# EAGLE design Hlibok_PCB (EAGLE 9.6.2)
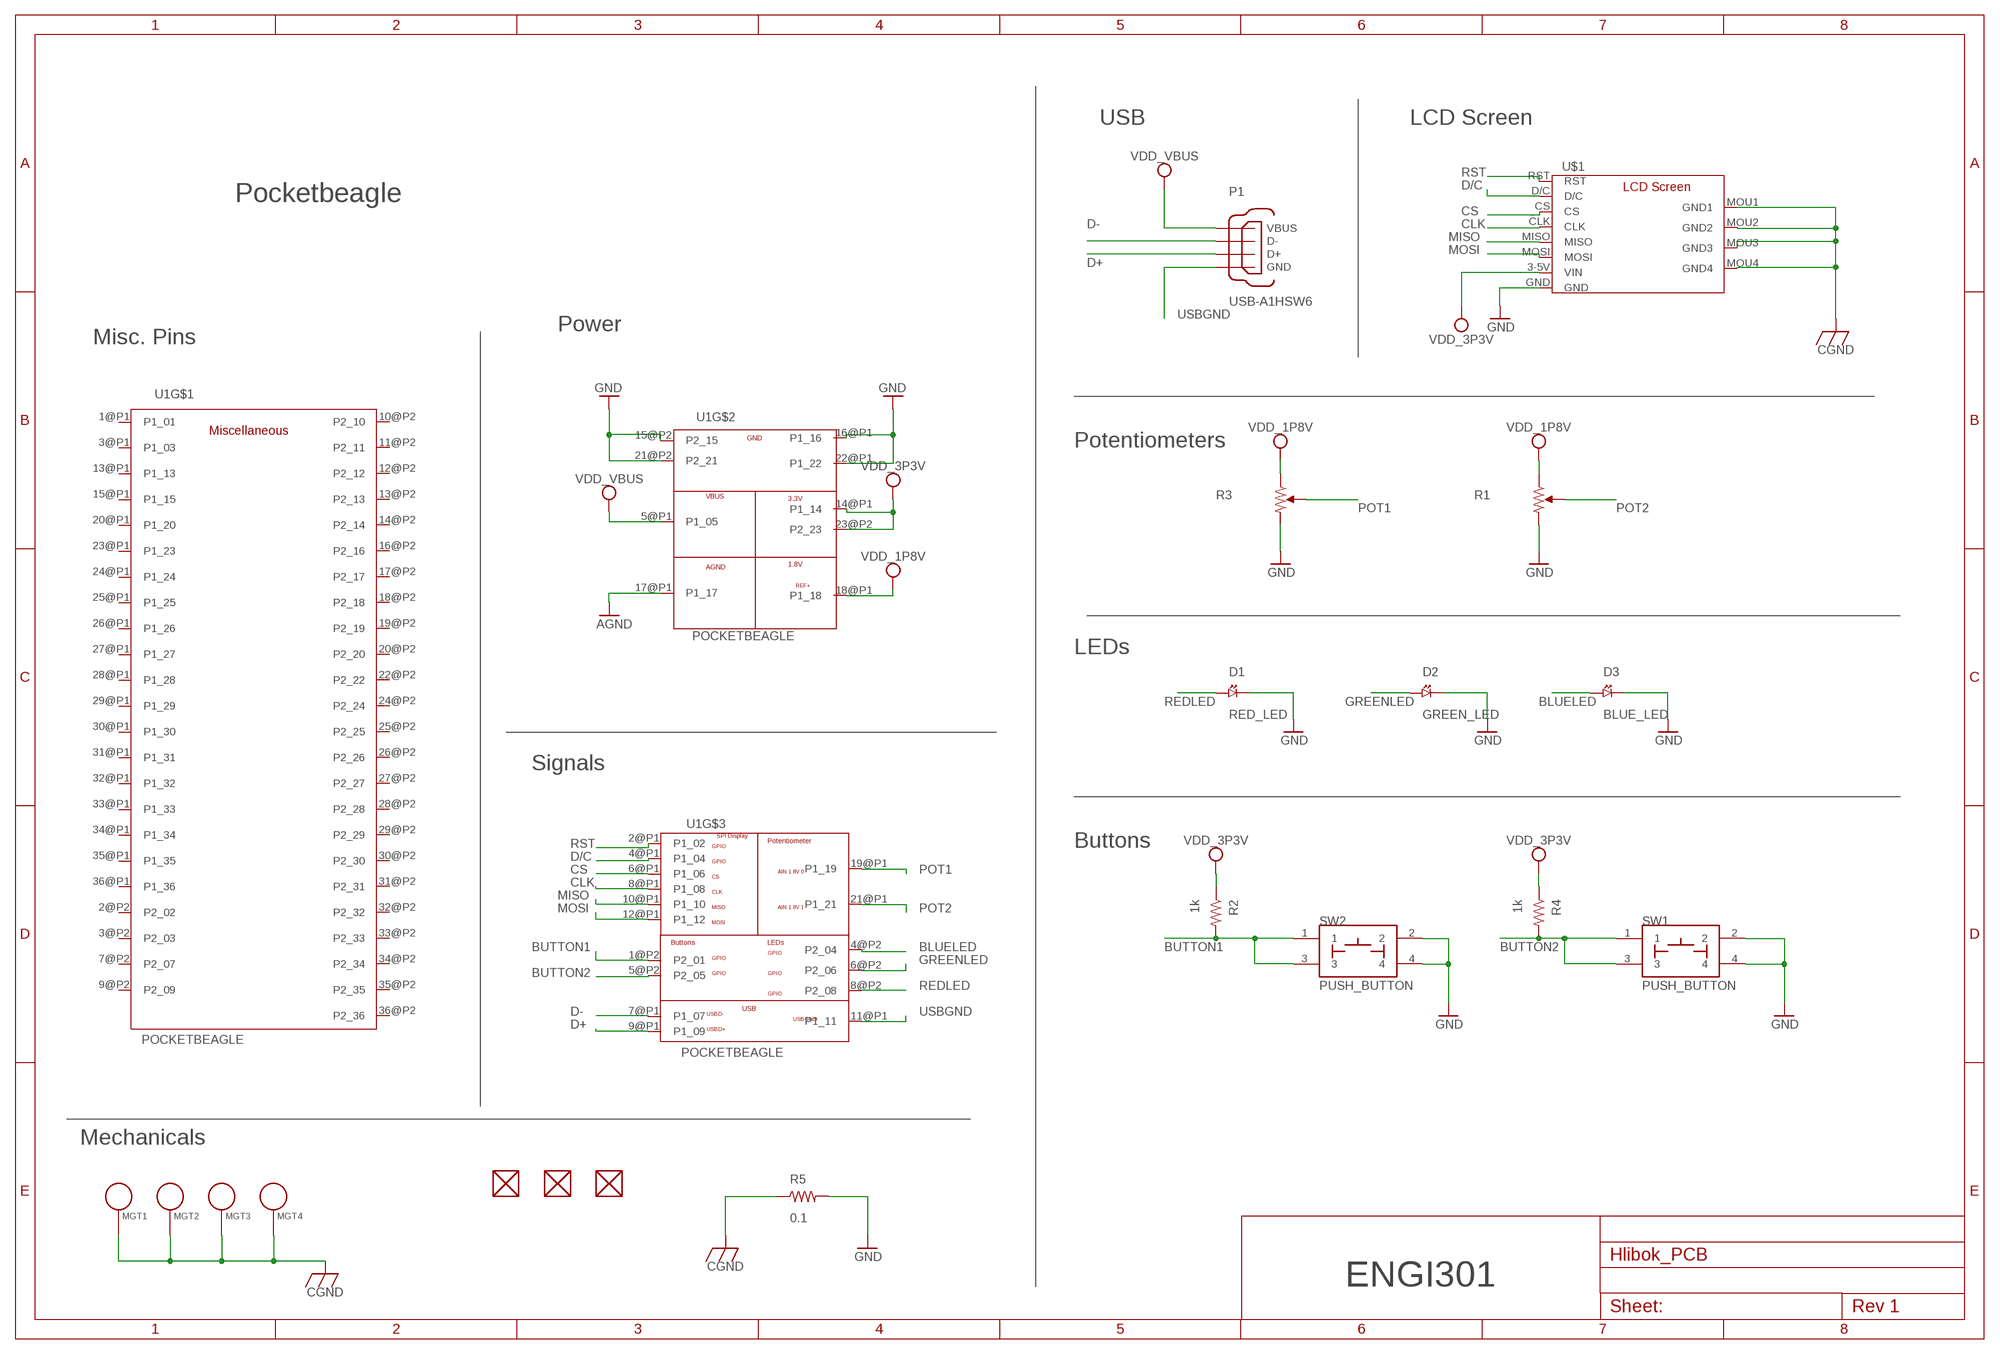
[diagram p0: schematic, sheet 1]

## Parts
D1  RED_LED  LED  [EIA-STD]
D2  GREEN_LED  LED  [EIA-STD]
D3  BLUE_LED  LED  [EIA-STD]
FUD1  FIDUCIAL  [FIDUCIAL_40MIL]
FUD2  FIDUCIAL  [FIDUCIAL_40MIL]
FUD3  FIDUCIAL  [FIDUCIAL_40MIL]
MGT1  MOUNTING_HOLE  [MOUNTING_HOLE]
MGT2  MOUNTING_HOLE  [MOUNTING_HOLE]
MGT3  MOUNTING_HOLE  [MOUNTING_HOLE]
MGT4  MOUNTING_HOLE  [MOUNTING_HOLE]
P1  USB-A1HSW6  [USB]
R1  POTENTIOMETER  [POT-PO90S]
R2  1k  R_R0603  [R0603]
R3  POTENTIOMETER  [POT-PO90S]
R4  1k  R_R0603  [R0603]
R5  0.1  R_R0805  [R0805]
SW1  PUSH_BUTTON  [BUTTON_12.5MM]
SW2  PUSH_BUTTON  [BUTTON_12.5MM]
U1  POCKETBEAGLE  [POCKETBEAGLE]
U$1  SCREEN  [SCREEN]

## Nets
BLUELED: D3.ANODE U1.4@P2(P2_04)
BUTTON1: R2.2 SW2.1 SW2.3 U1.1@P2(P2_01)
BUTTON2: R4.2 SW1.1 SW1.3 U1.5@P2(P2_05)
CGND: MGT1.P$1 MGT2.P$1 MGT3.P$1 MGT4.P$1 R5.1 U$1.MOU1(GND1) U$1.MOU2(GND2) U$1.MOU3(GND3) U$1.MOU4(GND4)
CLK: U1.8@P1(P1_08) U$1.CLK
CS: U1.6@P1(P1_06) U$1.CS
D+: P1.3(D+) U1.9@P1(P1_09)
D-: P1.2(D-) U1.7@P1(P1_07)
D/C: U1.4@P1(P1_04) U$1.D/C
GND: D1.CATHODE D2.CATHODE D3.CATHODE R1.CW R3.CW R5.2 SW1.2 SW1.4 SW2.2 SW2.4 U1.15@P2(P2_15) U1.16@P1(P1_16) U1.17@P1(P1_17) U1.21@P2(P2_21) U1.22@P1(P1_22) U$1.GND ; supply symbol labelled AGND
GREENLED: D2.ANODE U1.6@P2(P2_06)
MISO: U1.10@P1(P1_10) U$1.MISO
MOSI: U1.12@P1(P1_12) U$1.MOSI
POT1: R3.S U1.19@P1(P1_19)
POT2: R1.S U1.21@P1(P1_21)
REDLED: D1.ANODE U1.8@P2(P2_08)
RST: U1.2@P1(P1_02) U$1.RST
USBGND: P1.4(GND) U1.11@P1(P1_11)
VDD_1P8V: R1.CCW R3.CCW U1.18@P1(P1_18)
VDD_3P3V: R2.1 R4.1 U1.14@P1(P1_14) U1.23@P2(P2_23) U$1.3-5V(VIN)
VDD_5V: P1.1(VBUS) U1.5@P1(P1_05) ; supply symbol labelled VDD_VBUS
Unconnected: FUD1.P$1 FUD2.P$1 FUD3.P$1 U1.1@P1(P1_01) U1.2@P2(P2_02) U1.3@P1(P1_03) U1.3@P2(P2_03) U1.7@P2(P2_07) U1.9@P2(P2_09) U1.10@P2(P2_10) U1.11@P2(P2_11) U1.12@P2(P2_12) U1.13@P1(P1_13) U1.13@P2(P2_13) U1.14@P2(P2_14) U1.15@P1(P1_15) U1.16@P2(P2_16) U1.17@P2(P2_17) U1.18@P2(P2_18) U1.19@P2(P2_19) U1.20@P1(P1_20) U1.20@P2(P2_20) U1.22@P2(P2_22) U1.23@P1(P1_23) U1.24@P1(P1_24) U1.24@P2(P2_24) U1.25@P1(P1_25) U1.25@P2(P2_25) U1.26@P1(P1_26) U1.26@P2(P2_26) U1.27@P1(P1_27) U1.27@P2(P2_27) U1.28@P1(P1_28) U1.28@P2(P2_28) U1.29@P1(P1_29) U1.29@P2(P2_29) U1.30@P1(P1_30) U1.30@P2(P2_30) U1.31@P1(P1_31) U1.31@P2(P2_31) U1.32@P1(P1_32) U1.32@P2(P2_32) U1.33@P1(P1_33) U1.33@P2(P2_33) U1.34@P1(P1_34) U1.34@P2(P2_34) U1.35@P1(P1_35) U1.35@P2(P2_35) U1.36@P1(P1_36) U1.36@P2(P2_36)

## Notes on the sheet
- USB | LCD Screen
- Pocketbeagle
- Power
- Misc. Pins
- Potentiometers
- LEDs
- Signals
- Buttons
- Mechanicals
- ENGI301

## Library data of the parts
D1-D3 = Hlibok_PCB:LED: LTST-C191TBKT
FUD1-FUD3 = Hlibok_PCB:FIDUCIAL
MGT1-MGT4 = Hlibok_PCB:MOUNTING_HOLE: Chassis Mounting Hole w/GND connection ability
P1 = Hlibok_PCB:USB-A1HSW6: USB - A Receptacle Connector 4 Position Through Hole, Right Angle Check availability <https://pricing.snapeda.com/parts/USB-A1HSW6/On%20Shore/view-part?ref=eda>; AVAILABILITY: In Stock; CHECK_PRICES: https://www.snapeda.com/parts/USB-A1HSW6/On+Shore+Technology+Inc./view-part/?ref=eda; DESCRIPTION: USB-A (USB TYPE-A) - Receptacle Connector 4 Position Through Hole, Right Angle; MF: On Shore; MP: USB-A1HSW6; PACKAGE: None; PRICE: None; PURCHASE-URL: https://www.snapeda.com/api/url_track_click_mouser/?unipart_id=13110&manufacturer=On Shore&part_name=USB-A1HSW6&search_term=usb; SNAPEDA_LINK: https://www.snapeda.com/parts/USB-A1HSW6/On+Shore+Technology+Inc./view-part/?ref=snap
R1 R3 = Hlibok_PCB:POTENTIOMETER: Potentiometer - Examples: P090S-14T20BR10K (987-1277-ND)
R2 R4 R5 = Hlibok_PCB:R_: RESISTOR, American symbol
SW1 SW2 = Hlibok_PCB:PUSH_BUTTON
U1 = Hlibok_PCB:POCKETBEAGLE
U$1 = Hlibok_PCB:SCREEN

## Board
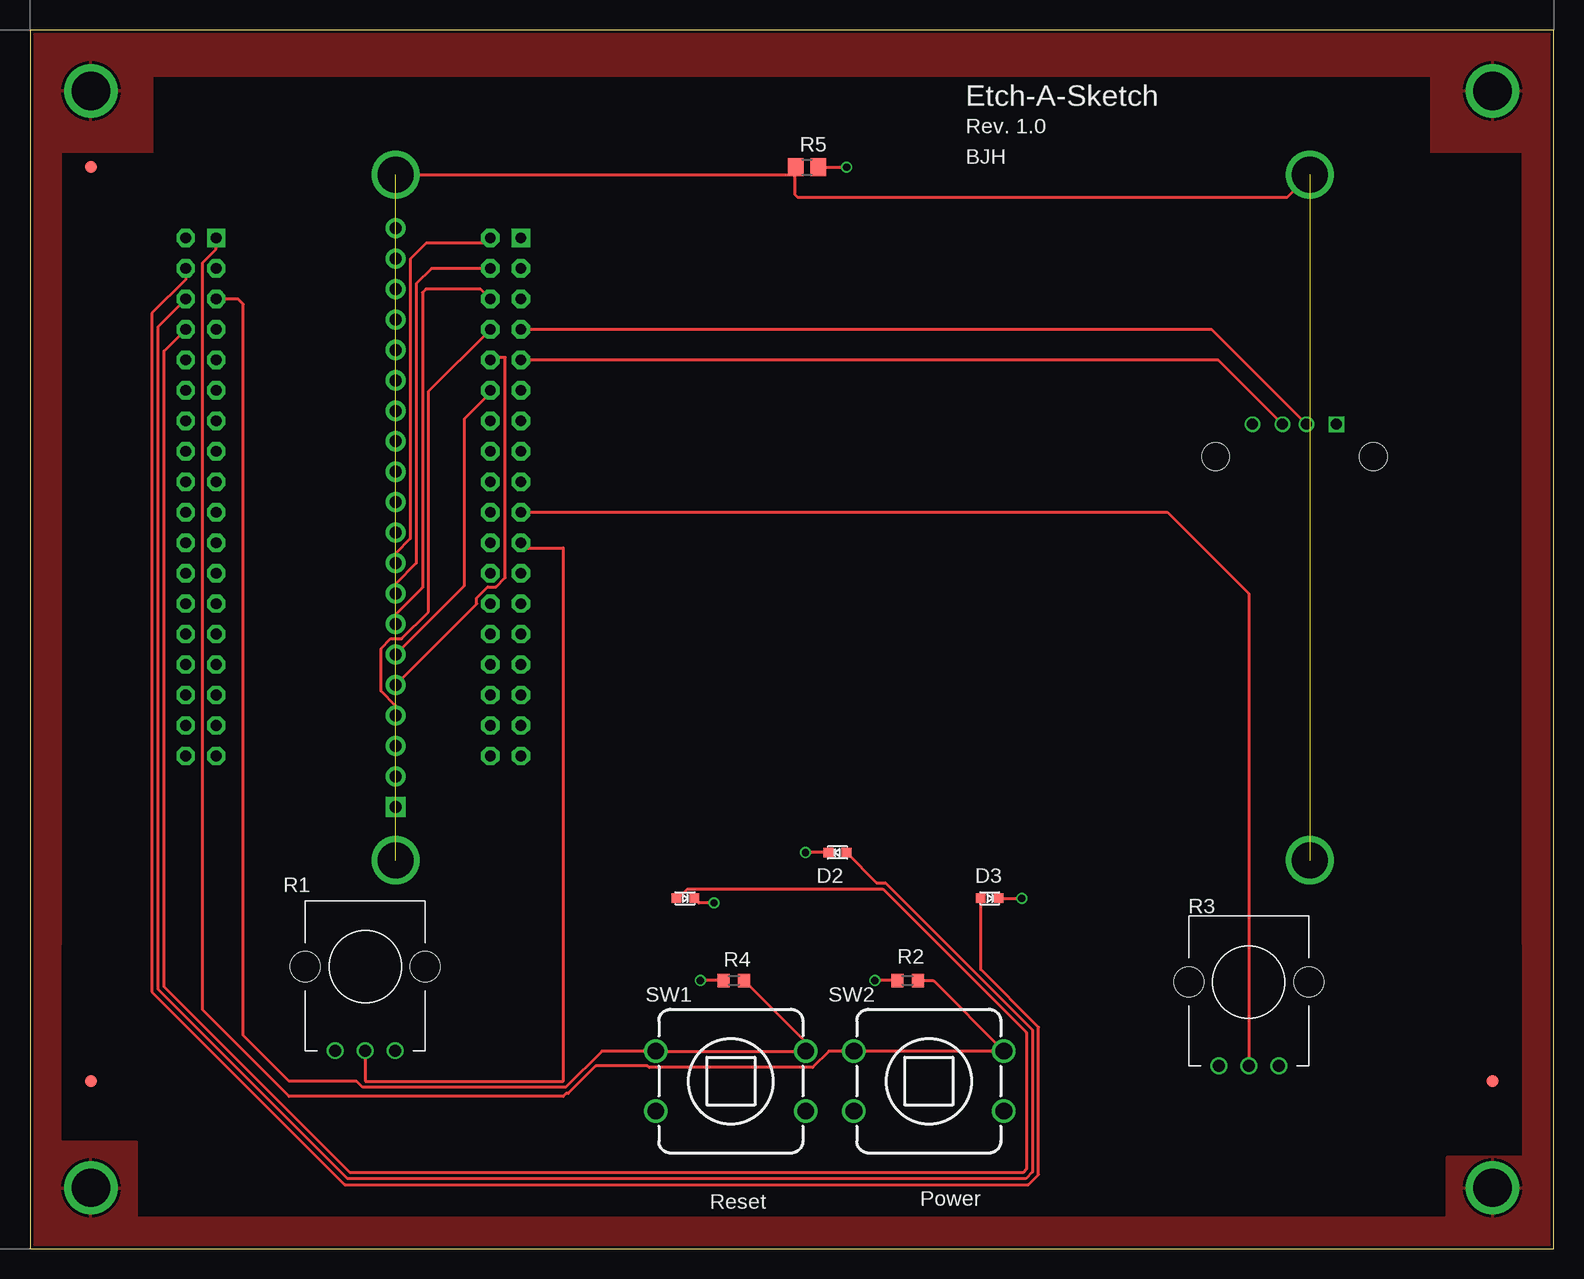
[diagram p1: board, top side]
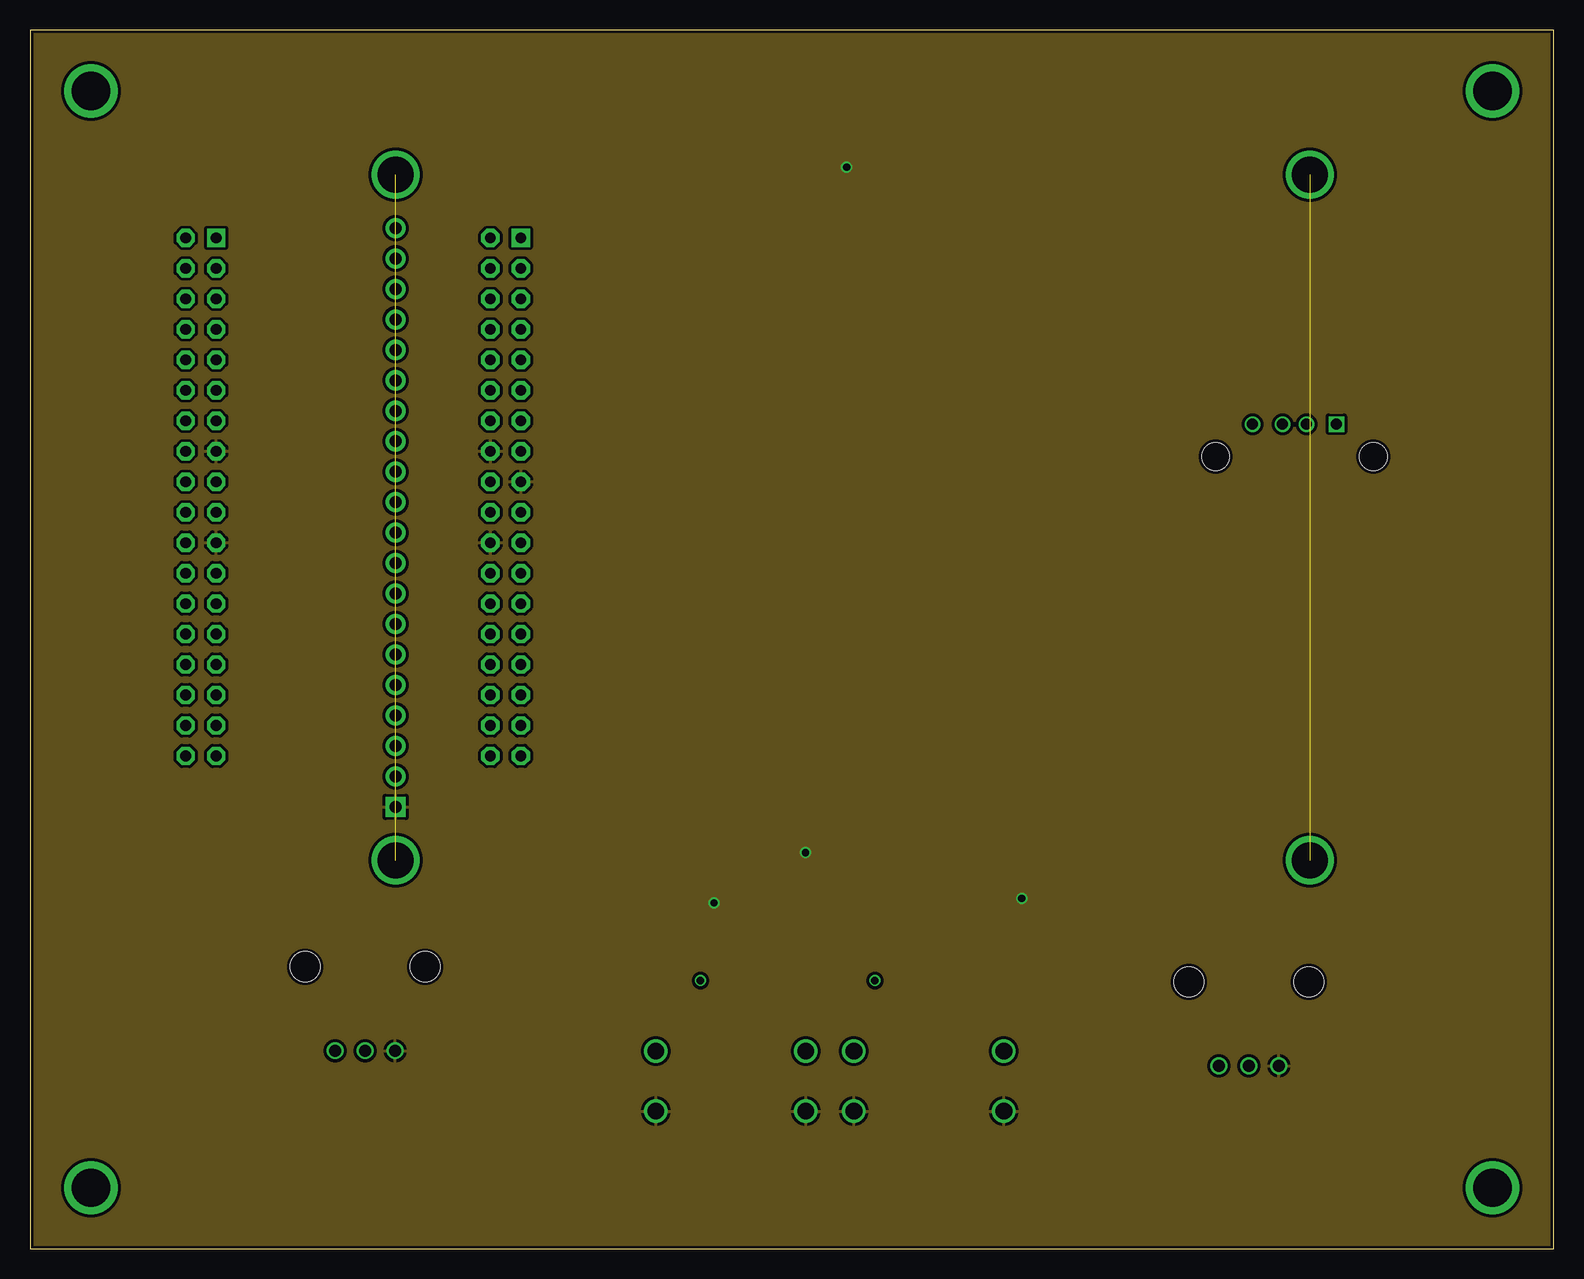
[diagram p2: board, inner layer Route2]
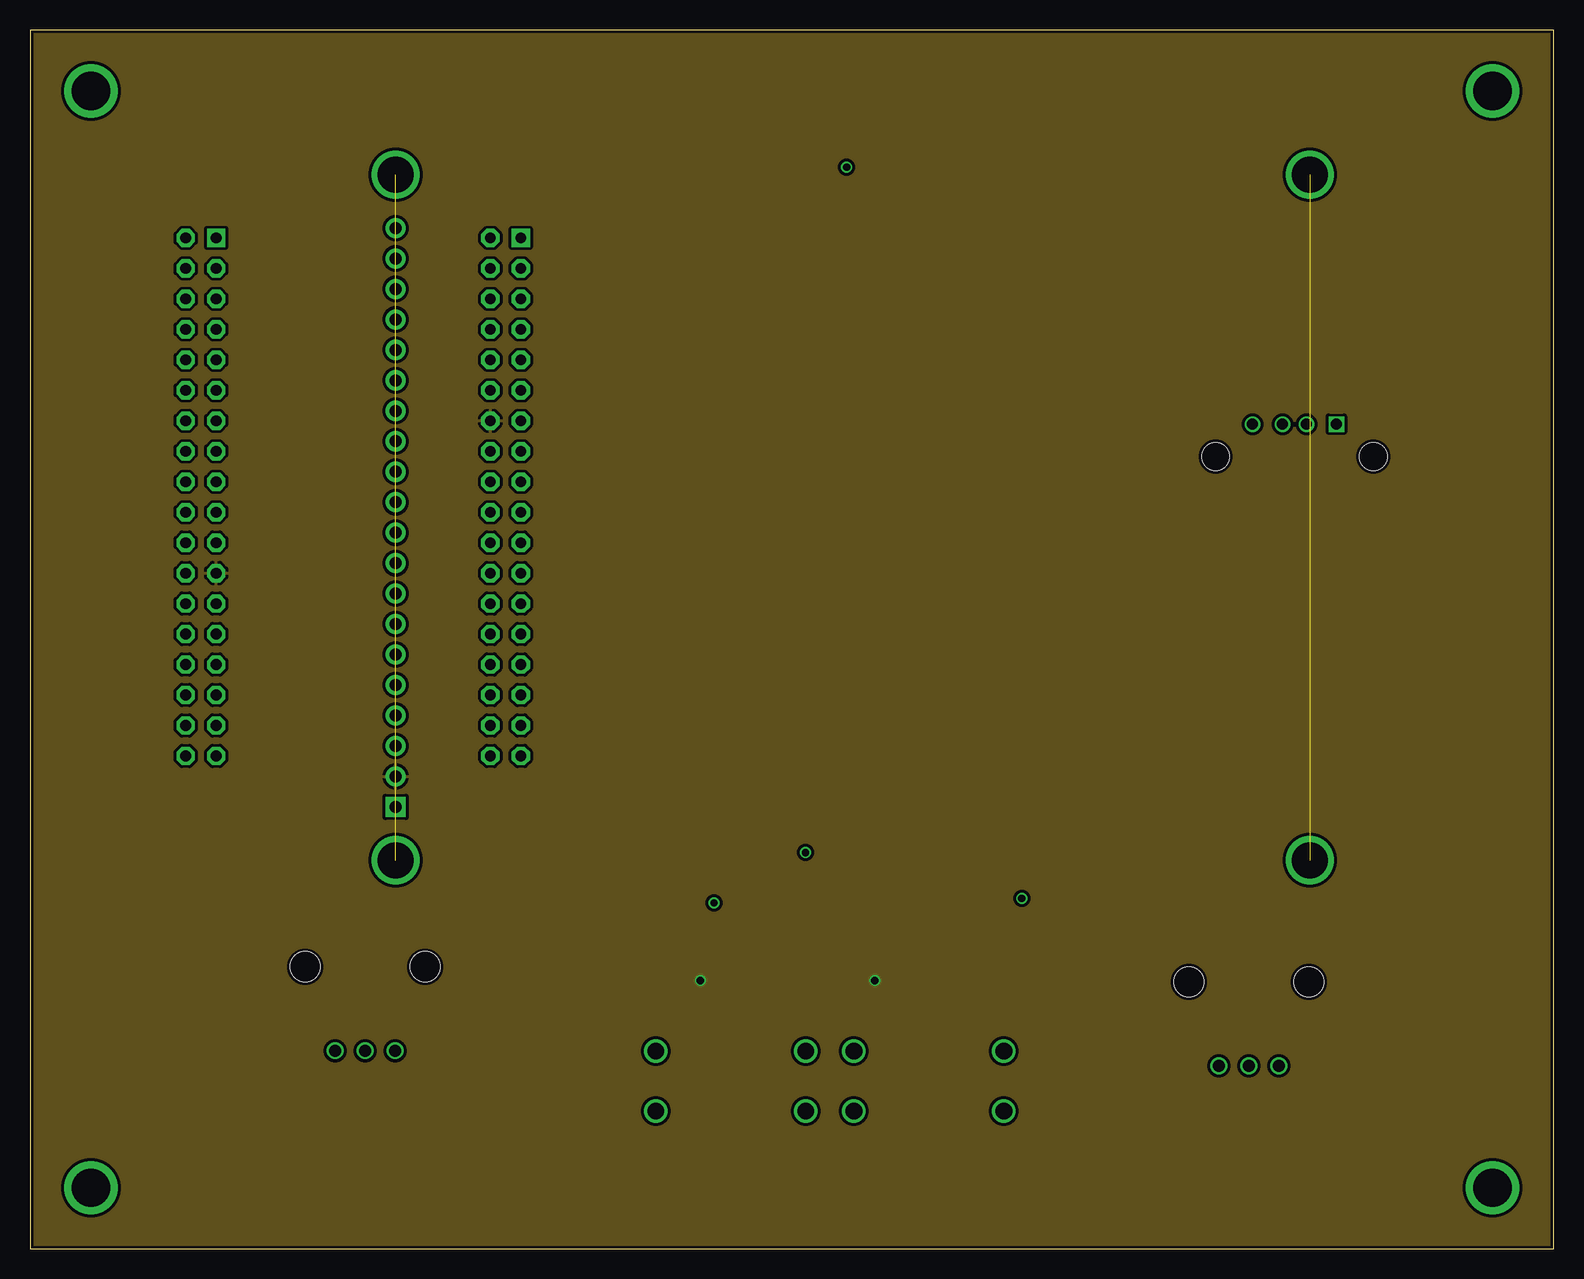
[diagram p3: board, inner layer Route15]
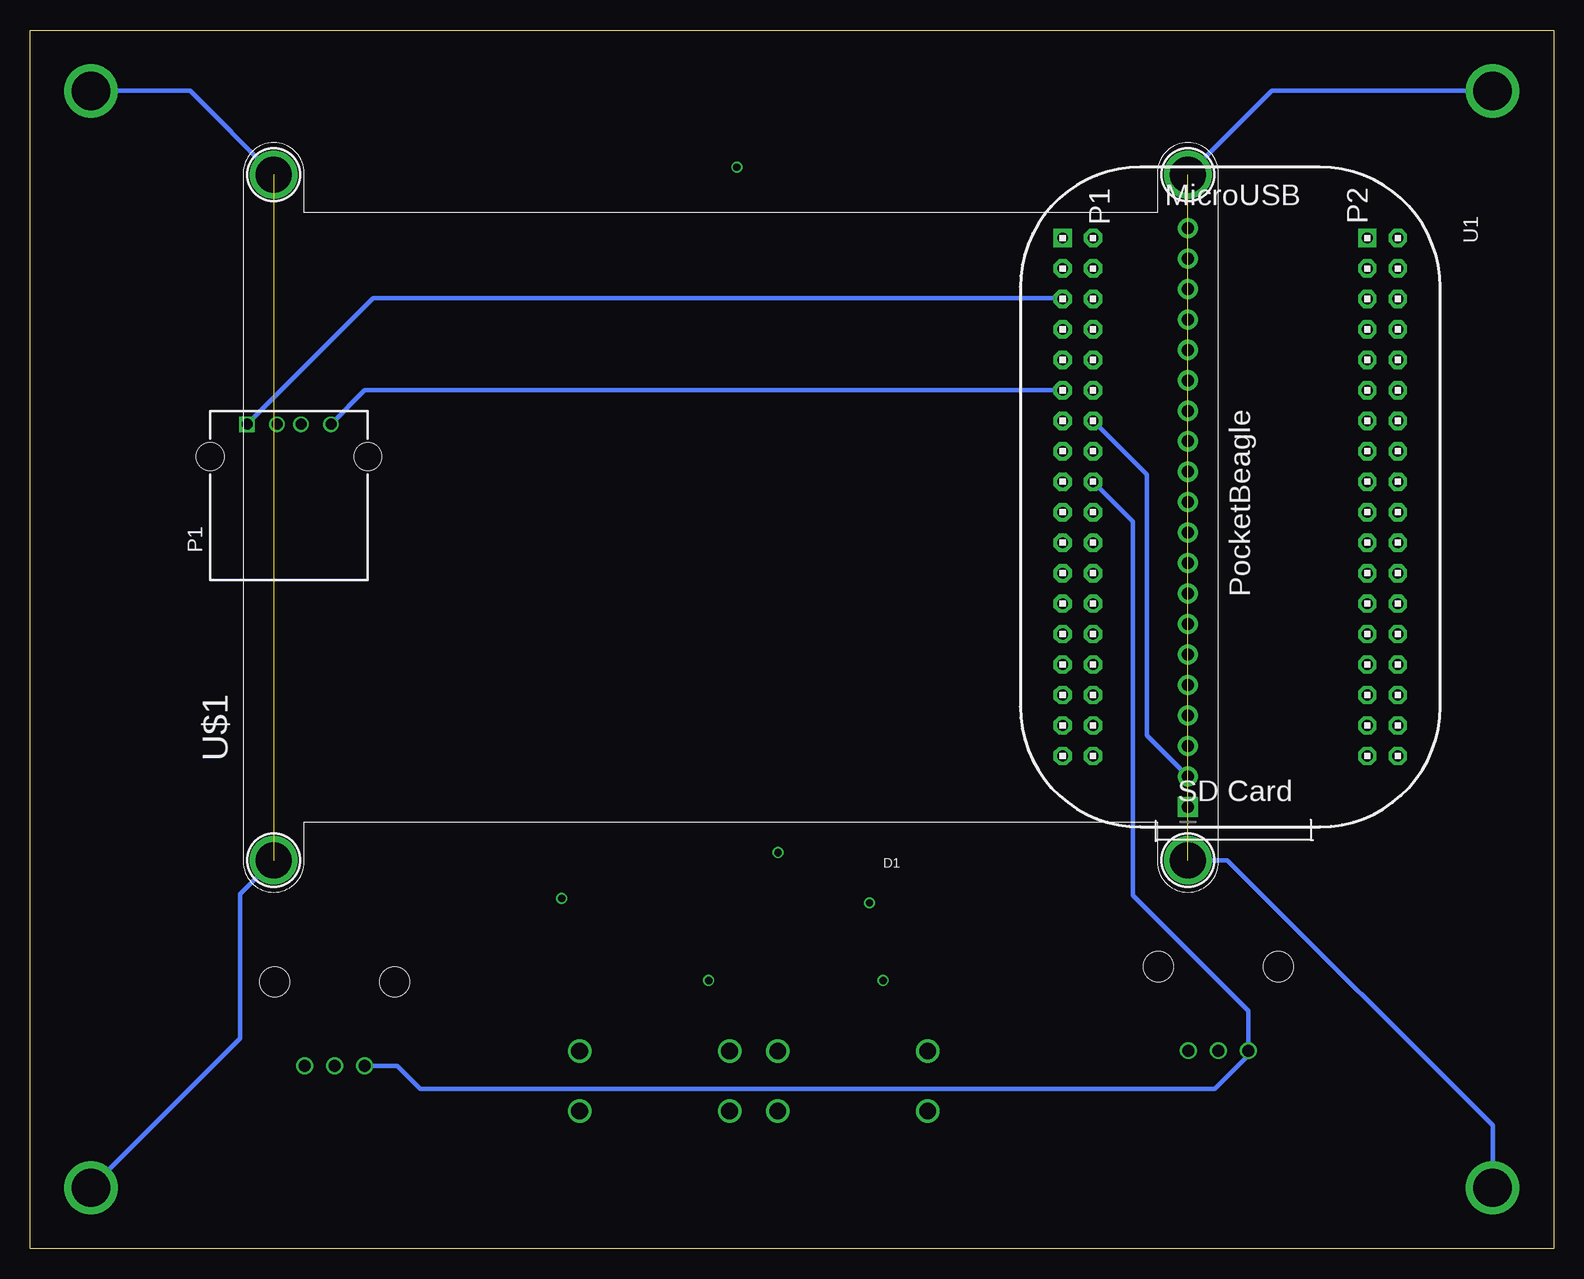
[diagram p4: board, bottom side, seen from below]

Size 127 x 101.6 mm. Coordinates in mm from the lower left corner, seen from the top.
Outline: 0,0 127,0 127,101.6 0,101.6 0,0
Copper layers (1*2*15*16): Top 0.035mm / dielectric 0.23mm / Route2 0.035mm / dielectric 0.93mm / Route15 0.035mm / dielectric 0.23mm / Bottom 0.035mm
Design rules "ENGI301_4lyr *": minimum track width 10mil, minimum drill 12mil, track to track 10mil, track to pad 10mil, pad to pad 10mil, via to via 10mil, smd to smd 10mil, copper to edge 10mil, drill to drill 12mil, minimum pad ring 6mil, minimum via ring 6mil, stop-mask expansion 3mil, vias tented up to drill 25mil, thermal gap 10mil

### Footprints (pad centres in the part's own frame; a part is rotated, then mirrored left to right if it is on the bottom)
EIA-STD = smd 0.8 x 0.8: ANODE -0.75,0; CATHODE 0.75,0
FIDUCIAL_40MIL = smd 1.016 x 1.016: P$1 0,0
MOUNTING_HOLE = drill 3.175 pad 4.445: P$1 0,0
USB = drill 0.92 square: 1 -3.5,6.51 | drill 0.92: 2 -1,6.51; 3 1,6.51; 4 3.5,6.51 | hole 2.3: -6.57,3.8; 6.57,3.8
POT-PO90S = drill 1: CCW -2.5,0; CW 2.5,0; S 0,0 | hole 2.5: -5,7; 5,7
R0603 = smd 1 x 1.1: 1 -0.85,0; 2 0.85,0
R0805 = smd 1.3 x 1.5: 1 -0.95,0; 2 0.95,0
BUTTON_12.5MM = drill 1.4: 1 -6.25,2.5; 2 -6.25,-2.5; 3 6.25,2.5; 4 6.25,-2.5
POCKETBEAGLE = drill 0.889 pad 1.524 square: 1@P1 5.91,3.53; 1@P2 5.91,28.93 | drill 0.889 pad 1.524 octagon: 2@P1 5.91,6.07; 2@P2 5.91,31.47; 3@P1 8.45,3.53; 3@P2 8.45,28.93; 4@P1 8.45,6.07; 4@P2 8.45,31.47; 5@P1 10.99,3.53; 5@P2 10.99,28.93; 6@P1 10.99,6.07; 6@P2 10.99,31.47; 7@P1 13.53,3.53; 7@P2 13.53,28.93; 8@P1 13.53,6.07; 8@P2 13.53,31.47; 9@P1 16.07,3.53; 9@P2 16.07,28.93; 10@P1 16.07,6.07; 10@P2 16.07,31.47; 11@P1 18.61,3.53; 11@P2 18.61,28.93; 12@P1 18.61,6.07; 12@P2 18.61,31.47; 13@P1 21.15,3.53; 13@P2 21.15,28.93; 14@P1 21.15,6.07; 14@P2 21.15,31.47; 15@P1 23.69,3.53; 15@P2 23.69,28.93; 16@P1 23.69,6.07; 16@P2 23.69,31.47; 17@P1 26.23,3.53; 17@P2 26.23,28.93; 18@P1 26.23,6.07; 18@P2 26.23,31.47; 19@P1 28.77,3.53; 19@P2 28.77,28.93; 20@P1 28.77,6.07; 20@P2 28.77,31.47; 21@P1 31.31,3.53; 21@P2 31.31,28.93; 22@P1 31.31,6.07; 22@P2 31.31,31.47; 23@P1 33.85,3.53; 23@P2 33.85,28.93; 24@P1 33.85,6.07; 24@P2 33.85,31.47; 25@P1 36.39,3.53; 25@P2 36.39,28.93; 26@P1 36.39,6.07; 26@P2 36.39,31.47; 27@P1 38.93,3.53; 27@P2 38.93,28.93; 28@P1 38.93,6.07; 28@P2 38.93,31.47; 29@P1 41.47,3.53; 29@P2 41.47,28.93; 30@P1 41.47,6.07; 30@P2 41.47,31.47; 31@P1 44.01,3.53; 31@P2 44.01,28.93; 32@P1 44.01,6.07; 32@P2 44.01,31.47; 33@P1 46.55,3.53; 33@P2 46.55,28.93; 34@P1 46.55,6.07; 34@P2 46.55,31.47; 35@P1 49.09,3.53; 35@P2 49.09,28.93; 36@P1 49.09,6.07; 36@P2 49.09,31.47
SCREEN = drill 1 pad 1.676: 3-5V -21.59,-38.1; 3.3V -19.05,-38.1; 11@JP2 1.27,-38.1; 12@JP2 3.81,-38.1; 13@JP2 6.35,-38.1; 14@JP2 8.89,-38.1; 15@JP2 11.43,-38.1; 16@JP2 13.97,-38.1; 17@JP2 16.51,-38.1; 18@JP2 19.05,-38.1; 19@JP2 21.59,-38.1; 20@JP2 24.13,-38.1; CLK -16.51,-38.1; CS -8.89,-38.1; D/C -6.35,-38.1; LITE -1.27,-38.1; MISO -13.97,-38.1; MOSI -11.43,-38.1; RST -3.81,-38.1 | drill 1 pad 1.676 square: GND -24.13,-38.1 | drill 3 pad 3.6: MOU1 -28.575,38.1; MOU2 28.575,38.1; MOU3 -28.575,-38.1; MOU4 28.575,-38.1

### Placement (x,y rotation side)
D1  54.61,29.21 0 top
D2  67.31,33.02 180 top
D3  80.01,29.21 0 top
FUD1  5.08,90.17 0 top
FUD2  5.08,13.97 0 top
FUD3  121.92,13.97 0 top
MGT1  121.92,96.52 270 top
MGT2  5.08,96.52 270 top
MGT3  5.08,5.08 270 top
MGT4  121.92,5.08 270 top
P1  105.41,62.23 0 bottom
R1  27.94,16.51 0 top
R2  73.15,22.35 0 top
R3  101.6,15.24 0 top
R4  58.67,22.35 0 top
R5  64.77,90.17 0 top
SW1  58.42,13.97 0 top
SW2  74.93,13.97 0 top
U1  44.45,90.17 270 bottom
U$1  68.58,60.96 90 bottom

### Tracks (layer width: path | path; a pad name or v marks a point on that pad's centre or on a via)
BLUELED
  Top 0.254: D3.ANODE 79.26,23.27 84.07,18.45 84.07,6.18 83.22,5.33 26.25,5.33 10.16,21.42 10.16,77.98 12.98,80.8 U1.4@P2
BUTTON1
  Top 0.254: U1.1@P2 15.52,83.34 14.38,82.19 14.38,19.91 21.59,12.7 44.45,12.7 44.7,12.95 44.87,12.95 47.16,15.24 51.48,15.24 51.61,15.11 65.23,15.11 66.59,16.47 SW2.1 SW2.3 75.3,22.35 R2.2
BUTTON2
  Top 0.254: U1.5@P2 17.34,79.18 17.78,78.74 17.78,17.78 21.59,13.97 27.22,13.97 27.73,13.46 44.66,13.46 47.67,16.47 SW1.1 SW1.3 64.67,17.21 R4.2
CGND  (2 unrouted)
  Top 0.254: U$1.MOU4 63.19,89.53 63.75,90.1 | U$1.MOU2 104.78,87.63 64.01,87.63 63.75,87.88 63.75,90.1 | 63.75,90.1 R5.1
  Bottom 0.381: U$1.MOU3 27.18,32.38 5.08,10.29 MGT3.P$1 | U$1.MOU1 109.47,29.59 109.47,17.53 MGT4.P$1 | U$1.MOU2 113.67,96.52 MGT1.P$1 | U$1.MOU4 23.5,96.52 MGT2.P$1
  pour Top: -1.27,25.4 -1.27,102.87 128.27,102.87 128.27,25.4 124.46,25.4 124.46,91.44 116.84,91.44 116.84,97.79 10.16,97.79 10.16,91.44 2.54,91.44 2.54,25.4
  pour Top: -1.27,25.4 -1.27,-1.27 128.27,-1.27 128.27,25.4 124.46,25.4 124.46,7.62 118.11,7.62 118.11,2.54 8.89,2.54 8.89,8.89 2.54,8.89 2.54,25.4
CLK
  Top 0.254: U1.8@P1 33.22,71.48 33.22,53.09 30.98,50.85 30.08,50.85 29.26,50.03 29.26,46.48 30.48,45.27 U$1.CLK
CS
  Top 0.254: U1.6@P1 37.55,80.01 33.02,80.01 32.72,79.7 32.72,55.12 30.48,52.89 U$1.CS
D+
  Top 0.254: P1.3 99.05,74.1 U1.9@P1
D-
  Top 0.254: P1.2 98.51,76.64 U1.7@P1
D/C
  Top 0.254: U1.4@P1 33.46,81.72 32.21,80.47 32.21,57.15 30.48,55.43 U$1.D/C
GND  (via drill 0.61 pad 0.61)
  Top 0.254: D1.CATHODE 55.74,28.83 v57.02,28.83 | D2.CATHODE v64.64,33.02 | D3.CATHODE v82.68,29.21 | R5.2 v68.07,90.17
  pour Route2: -2.54,-2.54 -2.54,104.14 129.54,104.14 129.54,-2.54
GREENLED
  Top 0.254: D2.ANODE 70.58,30.5 71.31,30.5 83.57,18.24 83.57,6.39 83.01,5.84 26.46,5.84 10.67,21.63 10.67,76.87 U1.6@P2
MISO
  Top 0.254: U$1.MISO 37.24,53.75 37.24,54.25 38.16,55.18 38.85,55.18 39.62,55.95 39.62,74.3 38.58,74.3 U1.10@P1
MOSI
  Top 0.254: U$1.MOSI 36.22,55.27 36.22,69.2 38.38,71.36 U1.12@P1
POT1
  Top 0.254: U1.19@P1 94.81,61.4 101.6,54.61 R3.S
POT2
  Top 0.254: R1.S 27.94,13.97 44.45,13.97 44.45,58.42 41.36,58.42 U1.21@P1
REDLED
  Top 0.254: D1.ANODE 54.02,29.21 54.8,29.99 71.1,29.99 83.06,18.03 83.06,6.6 82.8,6.35 26.67,6.35 11.18,21.84 11.18,74.84 U1.8@P2
RST
  Top 0.254: U1.2@P1 37.94,83.82 33.02,83.82 31.7,82.5 31.7,59.19 30.48,57.97 U$1.RST
USBGND
  Bottom 0.381: U1.11@P1 99.09,71.56 P1.4
VDD_1P8V
  Bottom 0.381: U1.18@P1 35.05,60.61 35.05,29.46 25.44,19.85 R1.CCW 25.44,16.13 28.23,13.34 94.49,13.34 96.39,15.24 R3.CCW
VDD_3P3V  (via drill 0.61 pad 0.61)
  Top 0.254: R2.1 v70.42,22.35 | R4.1 v55.88,22.35
  Bottom 0.381: U1.14@P1 33.91,64.55 33.91,42.8 U$1.3-5V
  pour Route15: -5.08,-5.08 -5.08,106.68 132.08,106.68 132.08,-5.08
VDD_5V
  Bottom 0.381: P1.1 98.4,79.25 40.99,79.25 U1.5@P1

### Text on the board
tPlace: Etch-A-Sketch | Rev. 1.0 | BJH | Power | Reset